# EAGLE design wirelessreceiver (EAGLE 6.0)
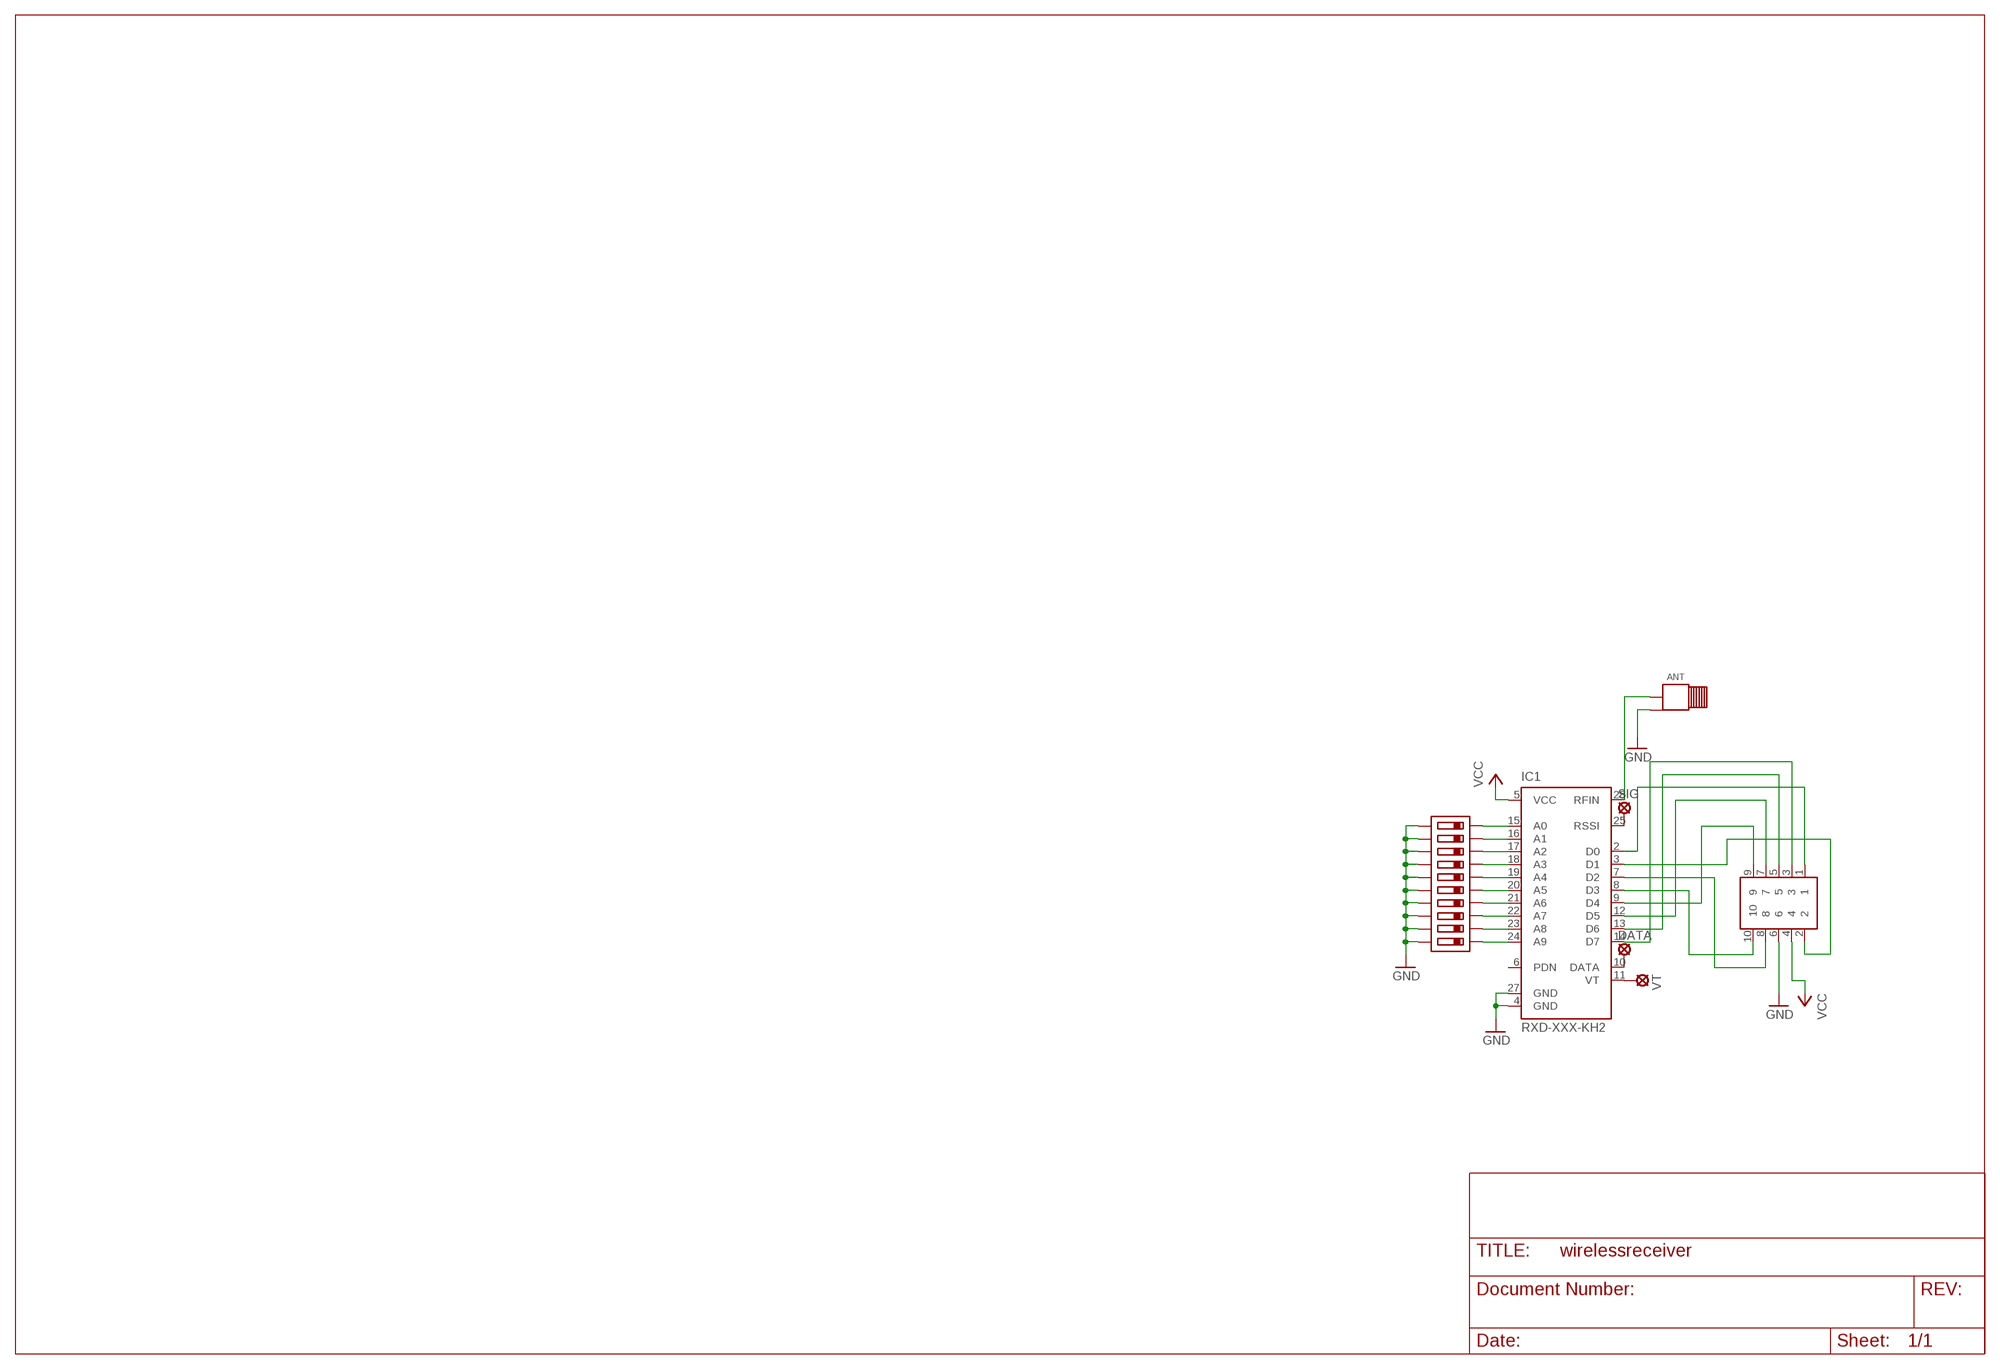
[diagram p0: schematic, sheet 1]

## Parts
ADDR  CT21910MST  [CT21910MST]
ANT  CONSMA002  [CONSMA002]
DATA  MCS10B  [MCS10B]
IC1  RXD-XXX-KH2  [RXD-XXX-KH2]
SIG  MCS10B  [MCS10B]
U$3  2X5-PHEADER  [2X5-SHROUDED-HEADER]
VT  MCS10B  [MCS10B]

## Nets
A0: ADDR.L9(A0) IC1.15(A0)
A1: ADDR.L8(A1) IC1.16(A1)
A2: ADDR.L7(A2) IC1.17(A2)
A3: ADDR.L6(A3) IC1.18(A3)
A4: ADDR.L5(A4) IC1.19(A4)
A5: ADDR.L4(A5) IC1.20(A5)
A6: ADDR.L3(A6) IC1.21(A6)
A7: ADDR.L2(A7) IC1.22(A7)
A8: ADDR.L1(A8) IC1.23(A8)
A9: ADDR.L0(A9) IC1.24(A9)
ANT: ANT.ANT IC1.28(RFIN)
D0: IC1.2(D0) U$3.1
D1: IC1.3(D1) U$3.2
D2: IC1.7(D2) U$3.8
D3: IC1.8(D3) U$3.10
D4: IC1.9(D4) U$3.9
D5: IC1.12(D5) U$3.7
D6: IC1.13(D6) U$3.5
D7: IC1.14(D7) U$3.3
GND: ADDR.R0(B9) ADDR.R1(B8) ADDR.R2(B7) ADDR.R3(B6) ADDR.R4(B5) ADDR.R5(B4) ADDR.R6(B3) ADDR.R7(B2) ADDR.R8(B1) ADDR.R9(B0) ANT.GND ANT.GND1(GND) ANT.GND2(GND) ANT.GND3(GND) IC1.4(GND) IC1.27(GND) U$3.6
N$1: IC1.25(RSSI) SIG.MP
N$3: DATA.MP IC1.10(DATA)
N$4: IC1.11(VT) VT.MP
VCC: IC1.5(VCC) U$3.4
Unconnected: IC1.6(PDN)

## Library data of the parts
ADDR = IEEE EAGLE Library:CT21910MST: 219-10MST 10-Position SMD DIP Switch
ANT = IEEE EAGLE Library:CONSMA002: CONSMA002: Board SMA Right-Angle Connector http://www.linxtechnologies.com/resources/diagrams/consma002-l.pdf
DATA SIG VT = solpad:MCS10B: SOLDER PAD MC S1, distributor Buerklin, 15F505
IC1 = linx:RXD-XXX-KH2: KH2 SERIES RECEIVER / DECODER Source: http://www.linxtechnologies.com .. RXD-xxx-KH2_Data_Guide.pdf; OC_FARNELL: unknown; OC_NEWARK: unknown
U$3 = IEEE EAGLE Library:2X5-PHEADER

## Board
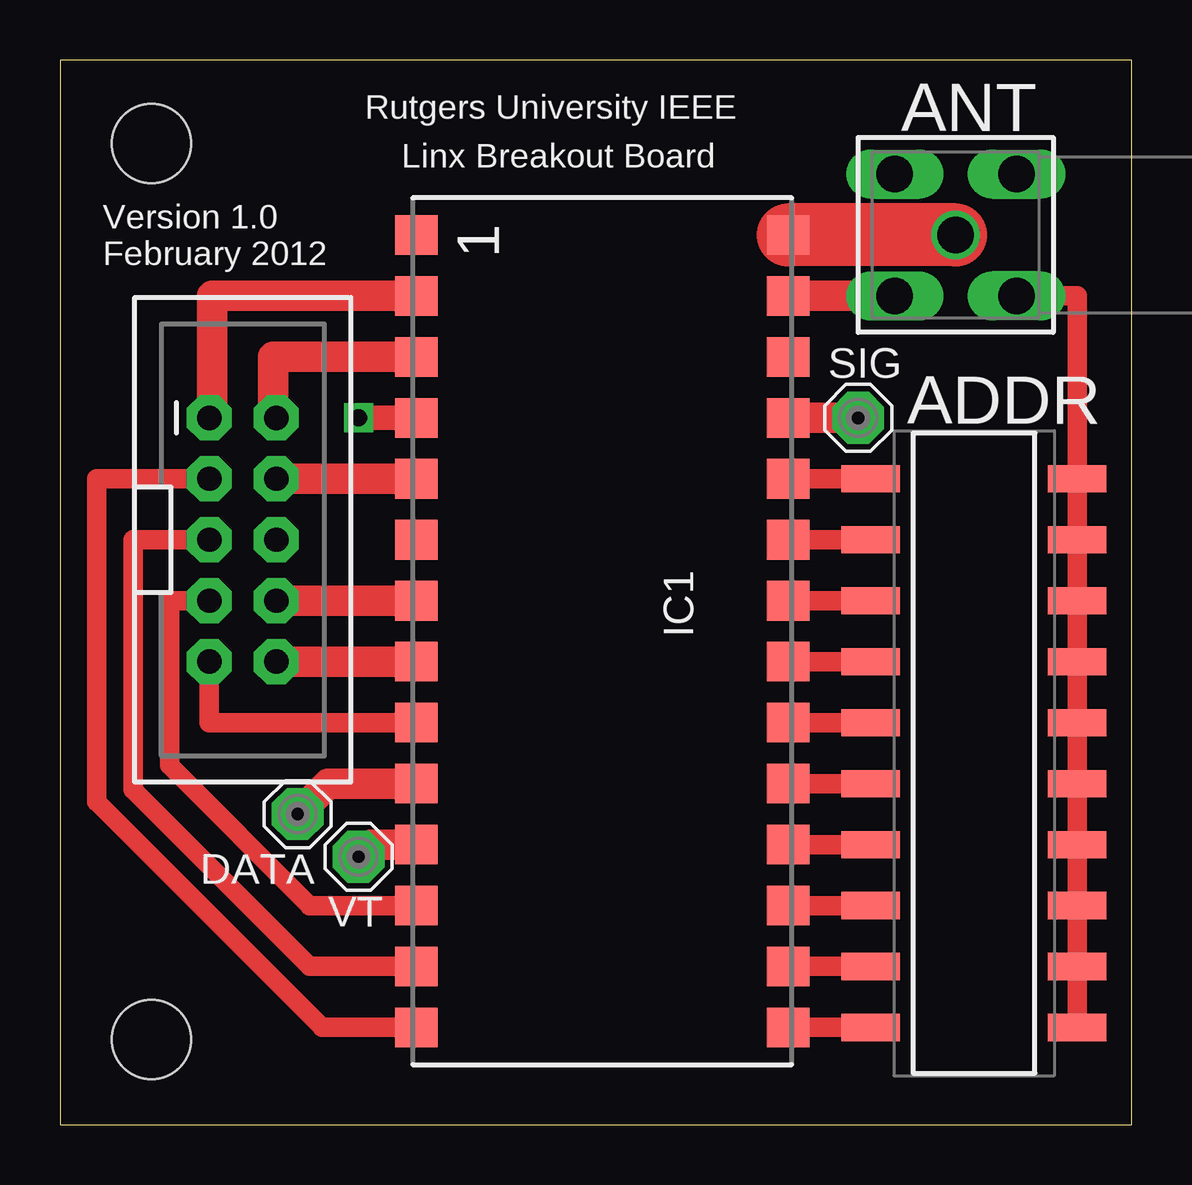
[diagram p1: board, top side]
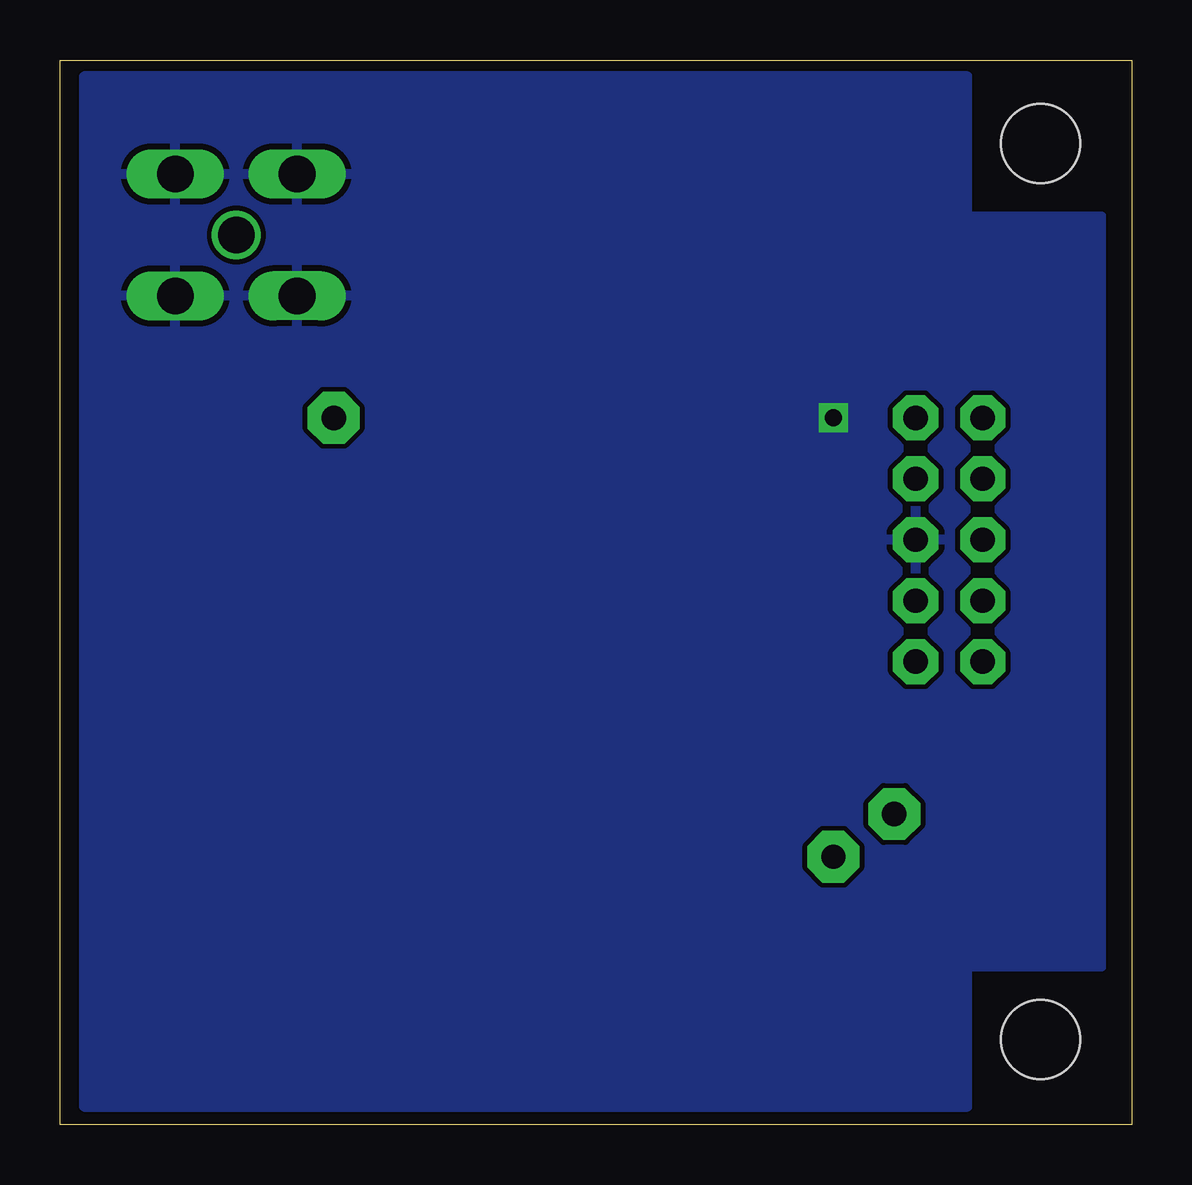
[diagram p2: board, bottom side, seen from below]

Size 44.68 x 44.37 mm. Coordinates in mm from the lower left corner, seen from the top.
Outline: 0,0 44.68,0 44.68,44.37 0,44.37 0,0
Copper layers (1*16): Top 0.035mm / dielectric 1.5mm / Bottom 0.035mm
Design rules: minimum track width 8mil, minimum drill 20mil, track to track 8mil, track to pad 8mil, pad to pad 8mil, via to via 8mil, smd to smd 8mil, copper to edge 10mil, drill to drill 8mil, minimum pad ring 10mil, minimum via ring 10mil, stop-mask expansion 4mil, vias tented up to drill 25mil, thermal gap 10mil

### Footprints (pad centres in the part's own frame; a part is rotated, then mirrored left to right if it is on the bottom)
CT21910MST = smd 2.44 x 1.13: L0 -4.3,11.43; L1 -4.3,8.89; L2 -4.3,6.35; L3 -4.3,3.81; L4 -4.3,1.27; L5 -4.3,-1.27; L6 -4.3,-3.81; L7 -4.3,-6.35; L8 -4.3,-8.89; L9 -4.3,-11.43; R0 4.3,11.43; R1 4.3,8.89; R2 4.3,6.35; R3 4.3,3.81; R4 4.3,1.27; R5 4.3,-1.27; R6 4.3,-3.81; R7 4.3,-6.35; R8 4.3,-8.89; R9 4.3,-11.43
CONSMA002 = drill 1.524: ANT 0,0 | drill 1.524 pad 1.27 long: GND -2.54,2.54; GND1 2.54,2.54; GND2 -2.54,-2.54; GND3 2.54,-2.54
MCS10B = drill 1.016 pad 2.159 octagon: MP 0,0
RXD-XXX-KH2 = smd 1.651 x 1.778: 1 -16.51,-7.747; 2 -13.97,-7.747; 3 -11.43,-7.747; 4 -8.89,-7.747; 5 -6.35,-7.747; 6 -3.81,-7.747; 7 -1.27,-7.747; 8 1.27,-7.747; 9 3.81,-7.747; 10 6.35,-7.747; 11 8.89,-7.747; 12 11.43,-7.747; 13 13.97,-7.747; 14 16.51,-7.747; 15 16.51,7.747; 16 13.97,7.747; 17 11.43,7.747; 18 8.89,7.747; 19 6.35,7.747; 20 3.81,7.747; 21 1.27,7.747; 22 -1.27,7.747; 23 -3.81,7.747; 24 -6.35,7.747; 25 -8.89,7.747; 26 -11.43,7.747; 27 -13.97,7.747; 28 -16.51,7.747
STAND-OFF = hole 3.302: 0,0
2X5-SHROUDED-HEADER = drill 1.016 pad 1.88 octagon: 1 3.683,15.24; 2 6.477,15.24; 3 3.683,12.7; 4 6.477,12.7; 5 3.683,10.16; 6 6.477,10.16; 7 3.683,7.62; 8 6.477,7.62; 9 3.683,5.08; 10 6.477,5.08

### Placement (x,y rotation side)
ADDR  38.1,15.49 0 top
ANT  37.34,37.08 0 top
DATA  9.91,12.95 0 top
IC1  22.61,20.57 270 top
SIG  33.27,29.46 0 top
U$1  [STAND-OFF]  3.81,40.89 0 top
U$2  [STAND-OFF]  3.81,3.56 0 top
U$3  2.54,14.22 0 top
VT  12.45,11.18 0 top

### Tracks (layer width: path | path; a pad name or v marks a point on that pad's centre or on a via)
A0
  Top 0.813: ADDR.L9 IC1.15
A1
  Top 0.813: ADDR.L8 IC1.16
A2
  Top 0.813: ADDR.L7 IC1.17
A3
  Top 0.813: ADDR.L6 IC1.18
A4
  Top 0.813: ADDR.L5 IC1.19
A5
  Top 0.813: ADDR.L4 IC1.20
A6
  Top 0.813: IC1.21 ADDR.L3
A7
  Top 0.254: 30.48,21.59 IC1.22
  Top 0.813: ADDR.L2 30.48,21.84 | 30.48,21.84 IC1.22 30.23,21.84 30.23,21.59 30.48,21.59 30.48,21.84
A8
  Top 0.813: ADDR.L1 IC1.23
A9
  Top 0.813: ADDR.L0 IC1.24
ANT
  Top 2.616: ANT.ANT IC1.28
D0
  Top 0.406: U$3.1 6.35,29.46
  Top 1.27: 6.35,29.46 6.35,34.54 IC1.2
D1
  Top 0.406: U$3.2 8.89,29.46
  Top 1.27: 8.89,29.46 8.89,32 IC1.3
D2
  Top 1.27: IC1.7 U$3.8
D3
  Top 1.27: IC1.8 U$3.10
D4
  Top 0.813: IC1.9 6.22,16.76 U$3.9
D5
  Top 0.813: U$3.7 4.57,21.84 4.57,14.99 10.41,9.14 IC1.12
D6
  Top 0.813: IC1.13 10.41,6.6 3.05,13.97 3.05,24.38 U$3.5
D7
  Top 0.813: U$3.3 1.52,26.92 1.52,13.46 10.92,4.06 IC1.14
GND  (via drill 0.7)
  Top 0.813: ADDR.R9 ADDR.R8 ADDR.R7 ADDR.R6 ADDR.R5 ADDR.R4 ADDR.R3 ADDR.R2 ADDR.R1 ADDR.R0 42.4,34.54 ANT.GND3 | IC1.4 15.24,29.46
  Top 1.016: IC1.4 v12.45,29.46
  Top 1.27: IC1.27 ANT.GND2
  pour Bottom: 1.27,37.85 6.86,37.85 6.86,43.69 43.69,43.69 43.69,0.76 6.86,0.76 6.86,6.6 1.27,6.6
N$1
  Top 1.27: SIG.MP IC1.25
N$3
  Top 1.27: IC1.10 11.18,14.22 DATA.MP
N$4
  Top 1.27: IC1.11 12.95,11.68 VT.MP
VCC
  Top 1.27: U$3.4 IC1.5

### Text on the board
_tsilk: Rutgers University IEEE | Linx Breakout Board | Version 1.0 | February 2012